# EAGLE design 311_lora_es920 (EAGLE 9.6.2)
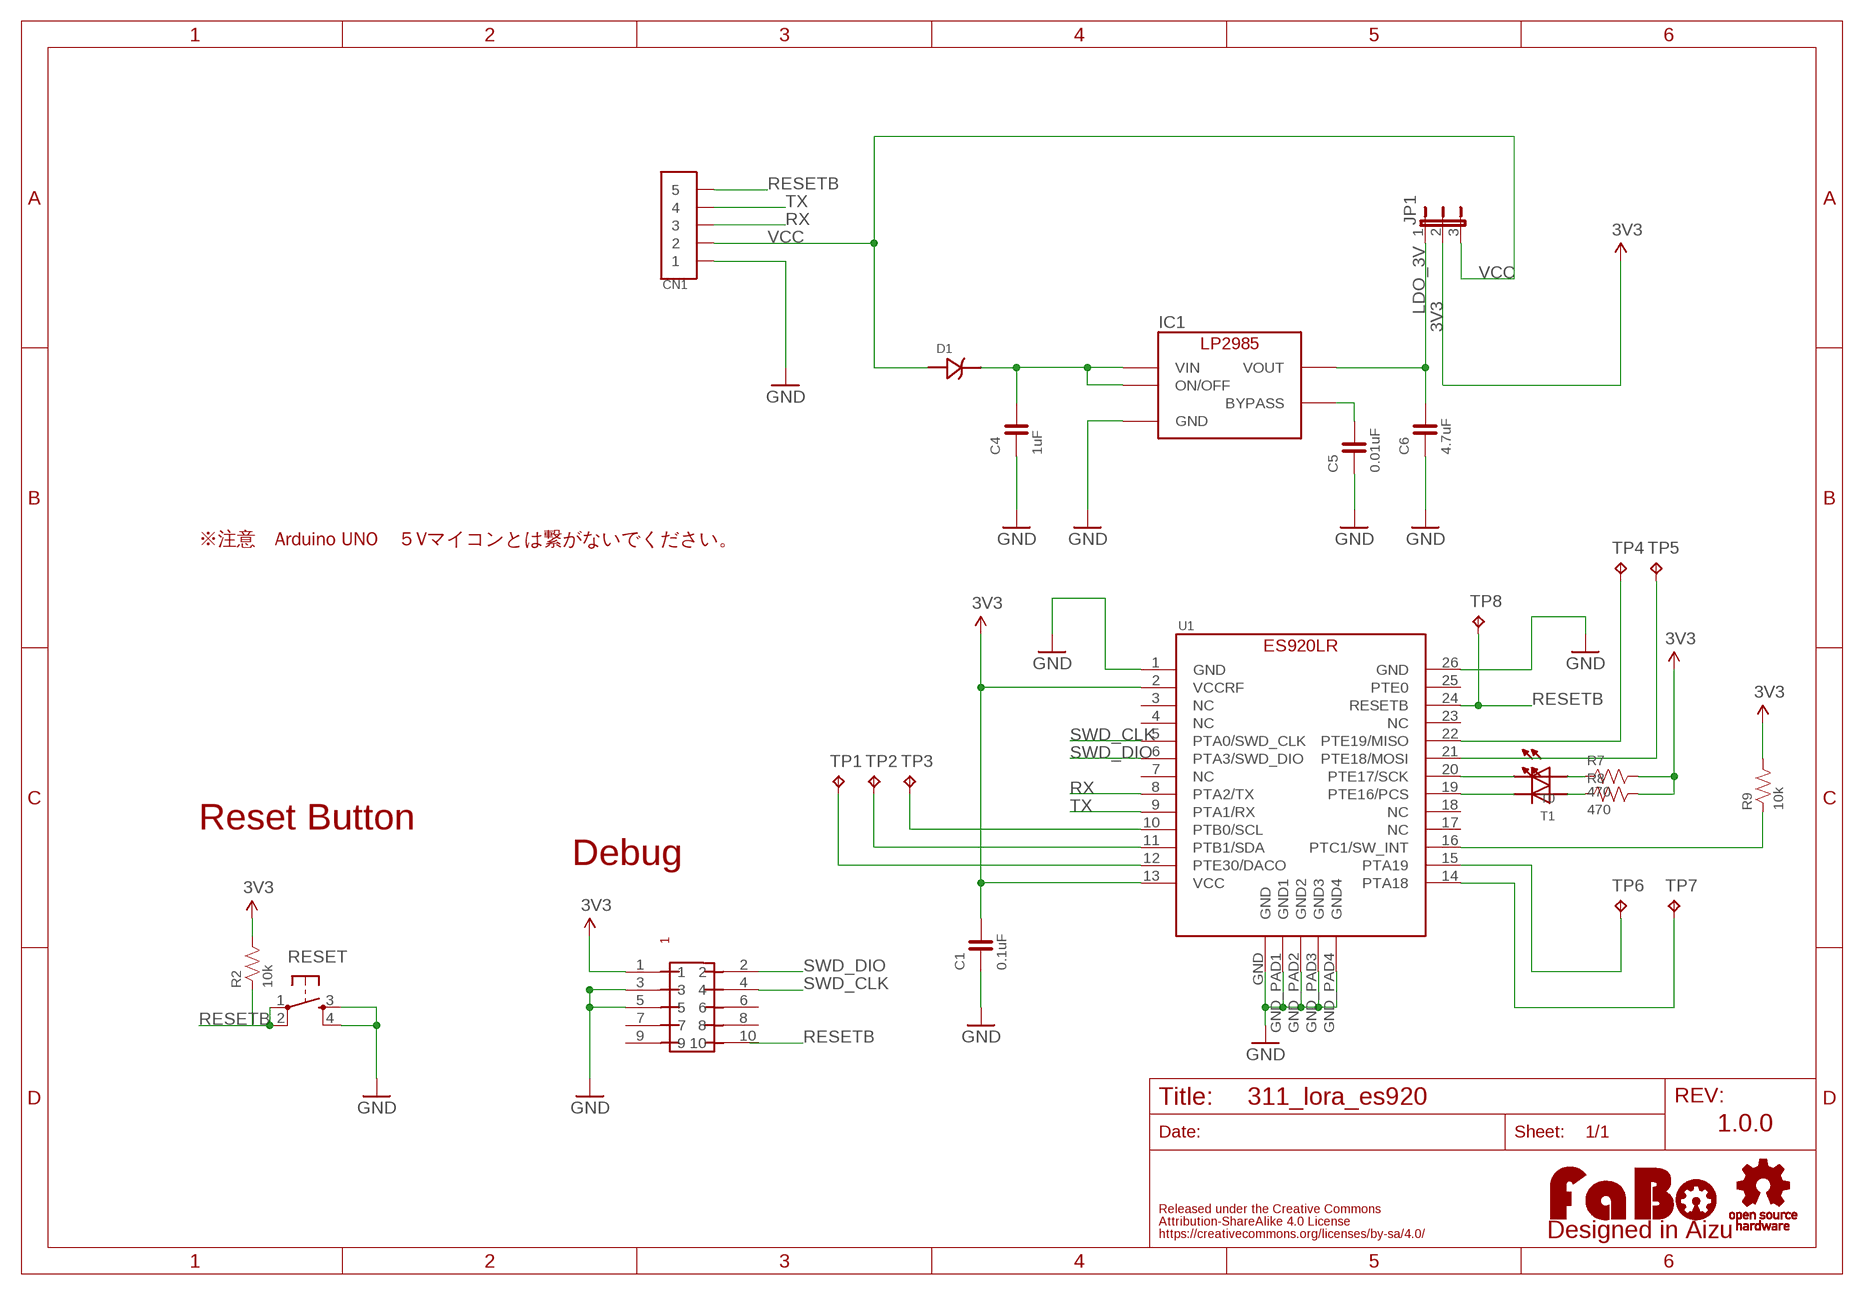
[diagram p0: schematic, sheet 1]

## Parts
C1  0.1uF  CAPACITOR-0603_NARROW  [0603-NARROW]
C4  1uF  CAPACITOR-0603_NARROW  [0603-NARROW]
C5  0.01uF  CAPACITOR-0603_NARROW  [0603-NARROW]
C6  4.7uF  CAPACITOR-0603_NARROW  [0603-NARROW]
CN1  SMD-CONN-5PIN-SM05B-PASS-1  [SM05B-PASS-1]
D1  CUS05F40  [CUS05F40]
IC1  LP2985-33DBV  [SOT-23-5]
JP1  JP2E  [JP2]
LOGO1  LOGO_FABO-M_BOTTOM  [LOGO_FABO_M_BOTTOM]
R2  10k  RESISTOR-0603-NARROW  [0603-NARROW]
R7  470  RESISTOR-0603-NARROW  [0603-NARROW]
R8  470  RESISTOR-0603-NARROW  [0603-NARROW]
R9  10k  RESISTOR-0603-NARROW  [0603-NARROW]
RESET  TACT-SWITCH-SMD_KMR2  [KMR2]
T0  LED-0603  [0603]
T1  LED-0603  [0603]
TP1  TPTP20R  [TP20R]
TP2  TPTP20R  [TP20R]
TP3  TPTP20R  [TP20R]
TP4  TPTP20R  [TP20R]
TP5  TPTP20R  [TP20R]
TP6  TPTP20R  [TP20R]
TP7  TPTP20R  [TP20R]
TP8  TPTP20R  [TP20R]
U1  ES920LR  [ES920LR]
U$3  LOGO_OSHW-M_BOTTOM  [LOGO_OSHW_M_BOTTOM]
U$8  PIN-HEADER-SMT(1.27MM)2X5  [PIN-HEADER-SMT(1.27MM)2X5]

## Nets
3V3: C1.2 JP1.2 R2.2 R7.2 R8.2 R9.2 U1.2(VCCRF) U1.13(VCC) U$8.1
GND: C1.1 C4.1 C5.1 C6.1 CN1.1 IC1.2(GND) RESET.3 RESET.4 U1.1(GND) U1.26(GND) U1.GND U1.GND_PAD1(GND1) U1.GND_PAD2(GND2) U1.GND_PAD3(GND3) U1.GND_PAD4(GND4) U$8.3 U$8.5
LDO_3V: C6.2 IC1.5(VOUT) JP1.1
N$3: T1.CATHODE U1.19(PTE16/PCS)
N$4: T0.CATHODE U1.20(PTE17/SCK)
N$5: R7.1 T0.ANODE
N$6: R8.1 T1.ANODE
N$7: R9.1 U1.16(PTC1/SW_INT)
N$9: C5.2 IC1.4(BYPASS)
N$10: TP6.TP U1.15(PTA19)
N$11: TP3.TP U1.10(PTB0/SCL)
N$12: TP2.TP U1.11(PTB1/SDA)
N$13: TP1.TP U1.12(PTE30/DACO)
N$14: TP4.TP U1.22(PTE19/MISO)
N$15: TP5.TP U1.21(PTE18/MOSI)
N$16: TP7.TP U1.14(PTA18)
N$17: C4.2 D1.C(CATHODE) IC1.1(VIN) IC1.3(ON/OFF)
RESETB: CN1.5 R2.1 RESET.1 RESET.2 TP8.TP U1.24(RESETB) U$8.10
RX: CN1.3 U1.8(PTA2/TX)
SWD_CLK: U1.5(PTA0/SWD_CLK) U$8.4
SWD_DIO: U1.6(PTA3/SWD_DIO) U$8.2
TX: CN1.4 U1.9(PTA1/RX)
VCC: CN1.2 D1.A(ANODE) JP1.3
Unconnected: U1.3(NC) U1.4(NC) U1.7(NC) U1.17(NC) U1.18(NC) U1.23(NC) U1.25(PTE0) U$8.6 U$8.7 U$8.8 U$8.9

## Notes on the sheet
- ※注意　Arduino UNO　５Vマイコンとは繋がないでください。
- Reset Button
- Debug
- 1.0.0

## Library data of the parts
C1 C4-C6 = FaBo-Capacitor:CAPACITOR: CAPACITOR
CN1 = FaBo-Connetor:SMD-CONN-5PIN
D1 = FaBo-Diode:CUS05F40
IC1 = FaBo-Supply:LP2985: LP2985
JP1 = jumper:JP2E: JUMPER
LOGO1 = component:LOGO_FABO
R2 R7-R9 = FaBo-Resistors:RESISTOR: RESISTOR
RESET = FaBo-Switch:TACT-SWITCH
T0 T1 = FaBo-LED:LED
TP1-TP8 = testpad:TP: Test pad
U1 = FaBo-LoRa:ES920LR
U$3 = component:LOGO_OSHW
U$8 = GClue:PIN-HEADER-SMT(1.27MM)2X5: PIN-HEADER-SMT (1.27MM) 2x5

## Board
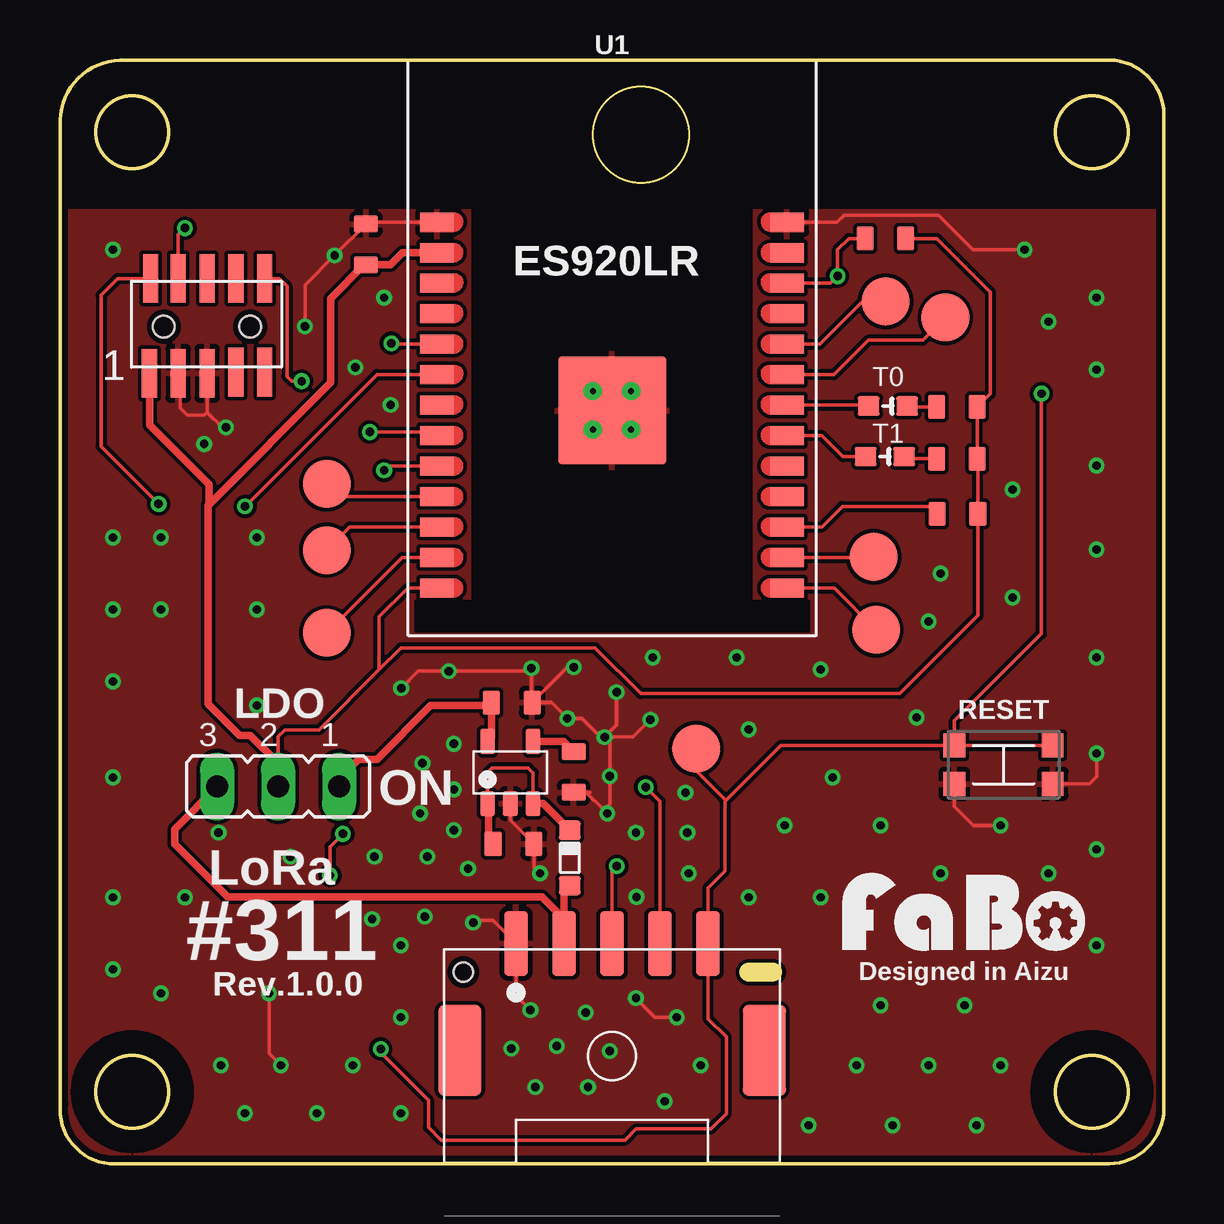
[diagram p1: board, top side]
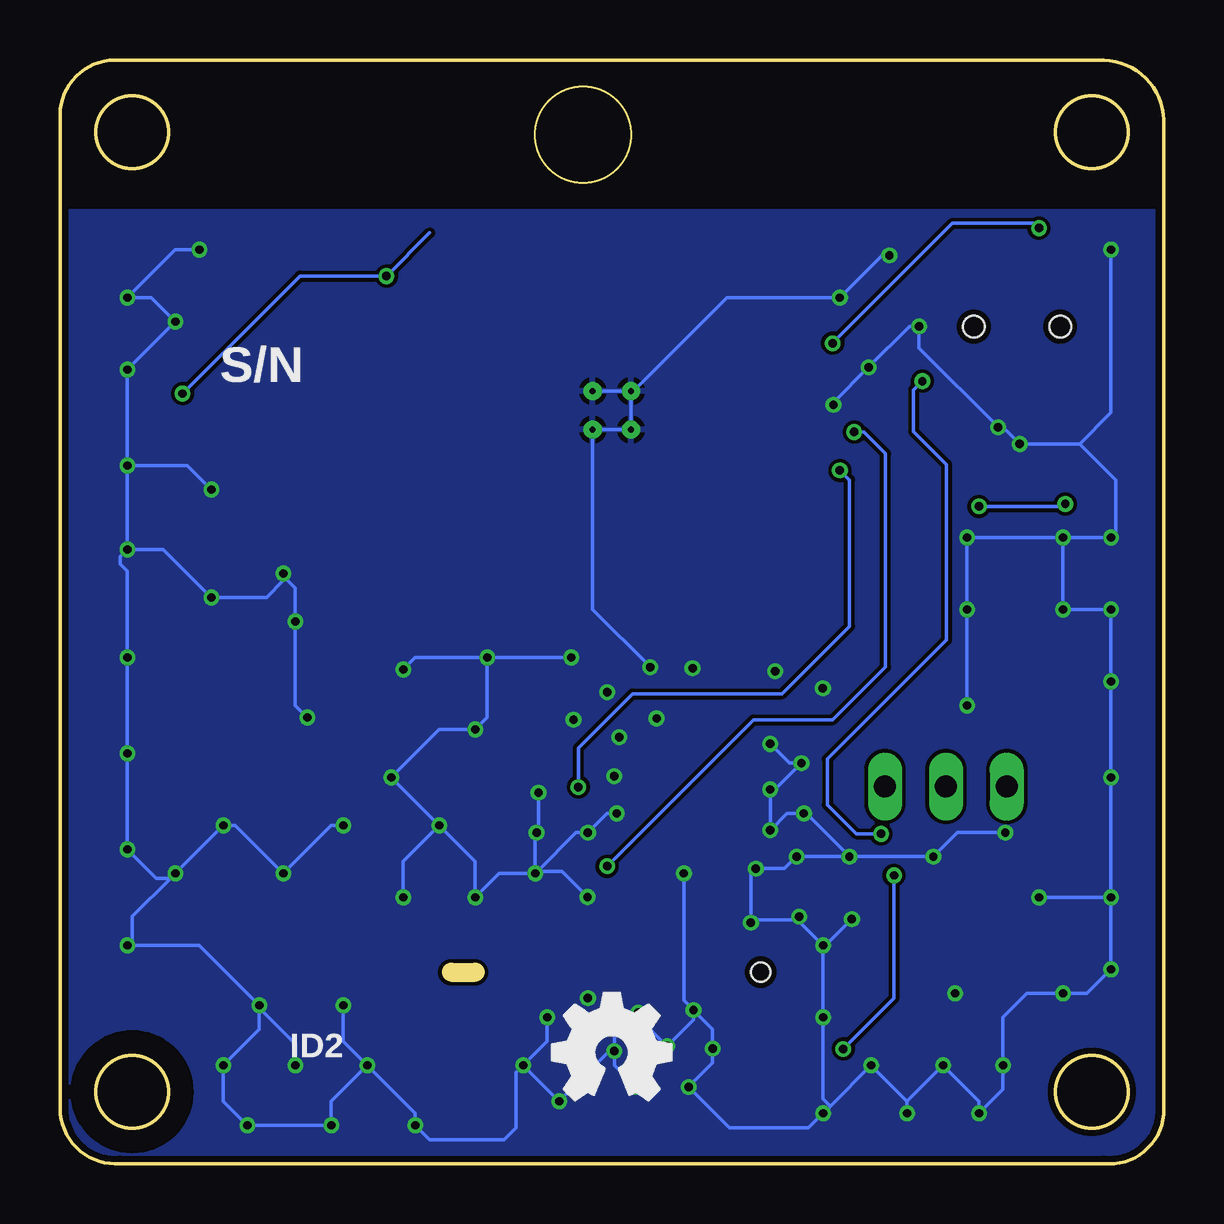
[diagram p2: board, bottom side, seen from below]

Size 46.02 x 46.02 mm. Coordinates in mm from the lower left corner, seen from the top.
Outline: 0.01,2.51 0.01,43.51 arc-87 2.51,46.01 43.51,46.01 arc-100 46.01,43.51 46.01,2.51 arc-99 43.51,0.01 2.51,0.01 arc-102 0.01,2.51
Outline: circle at 3.01,3.01 radius 1.5
Outline: circle at 43.01,3.01 radius 1.5
Outline: circle at 43.01,43.01 radius 1.5
Outline: circle at 3.01,43.01 radius 1.5
Copper layers (1*16): Top 0.035mm / dielectric 1.6mm / Bottom 0.035mm
Design rules "PCBway": minimum track width 6mil, minimum drill 12mil, track to track 6mil, track to pad 6mil, pad to pad 6mil, via to via 6mil, smd to smd 6mil, copper to edge 10mil, drill to drill 10mil, minimum pad ring 10mil, minimum via ring 6mil, stop-mask expansion 2mil, vias tented up to drill 100mil, thermal gap 8mil
tRestrict: area -2.6,39.8 to 50.4,50.8; area 0.5,0.5 to 5.5,5.5; area 40.5,0.5 to 45.5,5.5
bRestrict: area -2.6,39.8 to 50.4,50.8; area 40.5,0.5 to 45.5,5.5

### Footprints (pad centres in the part's own frame; a part is rotated, then mirrored left to right if it is on the bottom)
0603-NARROW = smd 0.71 x 1: 1 -0.85,0; 2 0.85,0
SM05B-PASS-1 = smd 1 x 2.7: 1 4,-11.85; 2 2,-11.85; 3 0,-11.85; 4 -2,-11.85; 5 -4,-11.85 | smd 1.8 x 3.8: P$1 6.35,-7.4; P$2 -6.35,-7.4 | hole 0.8: 6.2,-10.65
CUS05F40 = smd 0.8 x 0.9: A -1.15,0; C 1.15,0
SOT-23-5 = smd 0.6 x 1.05: 1 -0.95,-1.3; 2 0,-1.3; 3 0.95,-1.3; 4 0.95,1.3; 5 -0.95,1.3
JP2 = drill 0.914 long: 1 -2.54,0; 2 0,0; 3 2.54,0
KMR2 = smd 0.9 x 1: 1 -2.05,0.8; 2 2.05,0.8; 3 2.05,-0.8; 4 -2.05,-0.8
0603 = smd 0.9 x 0.8: ANODE -0.8,0; CATHODE 0.8,0
TP20R = smd 2 x 2: TP 0,0
ES920LR = smd 1.4 x 0.8: 1 -7.3,5.24; 2 -7.3,3.97; 3 -7.3,2.7; 4 -7.3,1.43; 5 -7.3,0.16; 6 -7.3,-1.11; 7 -7.3,-2.38; 8 -7.3,-3.65; 9 -7.3,-4.92; 10 -7.3,-6.19; 11 -7.3,-7.46; 12 -7.3,-8.73; 13 -7.3,-10; 14 7.3,-10; 15 7.3,-8.73; 16 7.3,-7.46; 17 7.3,-6.19; 18 7.3,-4.92; 19 7.3,-3.65; 20 7.3,-2.38; 21 7.3,0.16; 22 7.3,-1.11; 23 7.3,1.43; 24 7.3,2.7; 25 7.3,3.97; 26 7.3,5.24 | smd 4.5 x 4.5: GND 0,-2.6 | drill 0.25: GND_PAD1 -0.8,-1.8; GND_PAD2 0.8,-1.8; GND_PAD3 -0.8,-3.4; GND_PAD4 0.8,-3.4
PIN-HEADER-SMT(1.27MM)2X5 = smd 0.635 x 2.032: 1 -2.4,-1.95; 2 -2.35,2; 3 -1.2,-1.95; 4 -1.2,2; 5 0,-1.95; 6 0,2; 7 1.2,-1.9; 8 1.2,2; 9 2.4,-1.9; 10 2.4,2 | hole 0.9: 1.8,0; -1.8,0

### Placement (x,y rotation side)
C1  12.75,38.33 270 top
C4  18.9,13.34 180 top
C5  21.41,16.34 90 top
C6  18.83,19.23 180 top
CN1  23.01,-2.66 180 top
D1  21.25,12.76 90 top
IC1  18.77,16.32 0 top
JP1  9.09,15.73 180 top
LOGO1  37.68,8.52 0 bottom
R2  34.41,38.58 0 top
R7  37.39,31.56 0 top
R8  37.39,29.4 0 top
R9  37.41,27.11 0 top
RESET  39.33,16.64 0 top
T0  34.51,31.6 180 top
T1  34.39,29.49 180 top
TP1  11.12,22.14 0 top
TP2  11.12,25.59 0 top
TP3  11.12,28.35 0 top
TP4  36.91,35.28 0 top
TP5  34.42,35.96 0 top
TP6  33.92,25.31 0 top
TP7  34.02,22.27 0 top
TP8  26.51,17.31 0 top
U1  23.01,34.01 0 top
U$3  23.01,4.66 0 top
U$8  6.13,34.91 0 top

### Tracks (layer width: path | path; a pad name or v marks a point on that pad's centre or on a via)
3V3
  Top 0.152: 12.75,37.41 C1.2 | U1.13 14.51,24.01 13.31,22.81 13.31,20.61 | R8.2 38.24,29.51 | 38.24,29.51 R7.2 38.79,32.11 38.79,36.34 36.55,38.58 R2.2 | 38.24,29.51 38.26,29.49 R9.2 38.26,22.86 35.01,19.61 24.21,19.61 22.31,21.51 14.21,21.51 13.31,20.61 | 13.31,20.61 10.8,18.1 9.38,18.1 9.09,17.81 9.09,16.71
  Top 0.305: 6.21,27.49 6.21,28.31 3.73,30.79 U$8.1 | 6.21,27.49 6.18,27.46 6.18,19.17 7.48,17.87 7.93,17.87 9.09,16.71 JP1.2 | 6.21,27.49 11.28,32.56 11.28,36.08 12.68,37.48 C1.2 13.78,37.48 14.28,37.98 U1.2
GND  (via drill 0.35)
  Top 0.152: IC1.2 18.77,14.32 C4.1 19.75,12.37 v20.01,12.11 | 22.09,15.49 21.93,15.49 | 19.75,19.3 C6.1 20.49,19.23 v21.15,18.57 21.75,18.57 22.53,17.79 v22.7,17.79 | 19.75,19.3 21.16,20.71 v21.41,20.71 | U1.1 12.82,39.25 C1.1 v11.45,37.88 10.21,36.64 v10.21,34.91 | U$8.3 5.01,32.88 5.01,31.51 5.31,31.21 6.01,31.21 6.13,31.33 | U$8.5 6.13,31.33 | v19.61,6.41 19.01,7.01 CN1.1 18.05,10.15 17.31,10.15 v17.22,10.06 | 6.13,31.33 6.75,30.71 v6.91,30.71 | v9.21,4.11 8.71,4.61 v8.71,7.11 | U1.GND U1.GND_PAD2 | v22.81,14.61 22.67,14.75 | 22.67,14.75 21.93,15.49 | 21.93,15.49 C5.1 | v22.7,17.79 22.92,17.57 v22.92,16.17 22.92,15 22.67,14.75 | v25.71,6.11 24.81,6.11 v24.01,6.91 | v24.61,18.52 23.88,17.79 v22.7,17.79 | v22.7,17.79 23.2,18.29 v23.2,19.67 | v14.22,19.83 14.93,20.54 v16.21,20.54 19.52,20.54 v19.65,20.67 19.65,19.39 19.75,19.3 | U1.26 32.39,39.25 32.69,39.55 36.62,39.55 38.06,38.11 v40.21,38.11 | RESET.3 42.9,15.84 43.21,16.15 v43.21,17.11 | RESET.4 37.28,14.91 38.08,14.11 v39.21,14.11
  Bottom 0.152: v21.41,20.71 23.81,23.11 U1.GND_PAD4 U1.GND_PAD3 22.21,32.11 | 22.21,32.11 U1.GND_PAD1 U1.GND_PAD2 | v20.01,12.11 20.01,6.81 v19.61,6.41 | v11.45,37.88 11.75,37.88 v13.51,36.11 18.21,36.11 22.21,32.11 | 10.71,2.61 v9.21,4.11 7.71,2.61 v7.71,2.11 6.71,3.11 v6.71,4.11 6.71,6.11 5.71,7.11 v4.21,7.11 3.21,7.11 v2.21,8.11 v2.21,11.11 | v10.71,2.11 10.71,2.61 | 10.71,2.61 v12.21,4.11 13.91,2.41 | 13.91,2.41 v14.21,2.11 14.81,1.51 18.11,1.51 v19.81,3.21 18.81,4.21 v18.81,4.81 18.81,5.61 v19.61,6.41 | v5.21,11.11 v2.21,11.11 | v2.21,11.11 v2.21,16.11 v2.21,20.11 v2.21,23.11 v4.21,23.11 4.21,26.01 | 4.21,26.01 v4.21,26.11 v8.21,26.11 v8.21,23.11 v8.21,19.11 | 4.21,26.01 4.11,26.11 v2.21,26.11 2.01,26.31 2.01,28.51 3.51,30.01 | 3.51,30.01 v6.01,30.01 6.71,30.71 v6.91,30.71 10.21,34.01 v10.21,34.91 10.61,34.91 v12.31,33.21 13.78,31.74 v13.78,31.64 | v2.21,38.11 2.21,31.31 3.51,30.01 | v40.21,38.11 41.21,38.11 v43.21,36.11 42.21,36.11 v41.21,35.11 v43.21,33.11 v43.21,29.11 | v24.71,21.11 v28.21,21.11 | v28.21,21.11 31.21,21.11 v31.71,20.61 | v28.21,21.11 28.21,18.61 v28.71,18.11 30.21,18.11 v32.21,16.11 v30.21,14.11 | v30.21,14.11 28.71,12.61 v28.71,11.11 27.71,12.11 v26.21,12.11 | v30.21,14.11 31.71,12.61 v31.71,11.11 | v26.21,12.11 26.12,12.2 | 26.12,12.2 24.51,13.81 v24.01,13.81 23.21,14.61 v22.81,14.61 | v13.01,10.21 14.11,9.11 v14.21,9.11 | v14.21,9.11 15.21,10.11 v15.21,10.31 15.35,10.17 17.11,10.17 v17.22,10.06 17.22,12.1 v17.01,12.31 15.81,12.31 v15.31,12.81 v13.11,12.81 | v13.11,12.81 14.91,14.61 v15.01,14.61 15.71,14.61 v16.41,13.91 v16.41,15.61 16.21,15.61 v15.11,16.71 15.61,16.71 v16.41,17.51
  Bottom 0.152: v6.61,13.81 8.61,13.81 v9.61,12.81 v13.11,12.81 | 13.91,2.41 14.21,2.71 v14.21,6.11 v14.21,9.11 | v19.61,6.41 19.61,6.01 v20.71,4.91 21.91,6.11 v21.91,6.31 22.91,5.31 v22.91,4.71 | v22.91,4.71 22.91,4.11 v22.01,3.21 | v22.91,4.71 23.11,4.71 v25.21,2.61 v26.71,4.11 | v26.71,4.11 25.71,5.11 v25.71,6.11 | v26.71,4.11 27.01,3.81 27.01,1.51 27.51,1.01 30.61,1.01 v31.21,1.61 31.21,2.11 v33.21,4.11 | v33.21,4.11 34.71,2.61 v34.71,1.61 v38.21,1.61 39.21,2.61 v39.21,4.11 37.71,5.61 37.71,6.51 | 37.71,6.51 v37.71,6.61 40.21,9.11 43.01,9.11 | v36.21,4.11 36.21,5.01 37.71,6.51 | v34.21,6.61 34.21,5.11 v33.21,4.11 | 43.01,9.11 v43.21,9.11 | 41.41,11.91 v41.21,12.11 v39.21,14.11 38.71,14.11 v36.71,12.11 34.71,14.11 v34.21,14.11 | 41.41,11.91 43.01,10.31 43.01,9.11 | 41.41,11.91 42.01,11.91 v43.21,13.11 v43.21,17.11 v43.21,21.11 43.21,24.71 43.51,25.01 43.51,25.31 v43.21,25.61 | 36.71,24.51 36.71,24.31 37.41,23.61 v39.71,23.61 41.71,25.61 v43.21,25.61 | 36.71,24.51 v36.71,24.61 | 36.71,24.51 36.21,24.01 v36.21,22.61 36.21,19.11 v35.71,18.61 | v39.71,28.11 40.71,29.11 v43.21,29.11 | v43.21,25.61 v43.21,29.11 | v24.03,11.13 25.1,12.2 26.12,12.2 | v26.21,12.11 26.21,13.75 v26.15,13.81 26.07,13.89 v26.07,15.48
  pour Bottom: -11.79,-5.09 56.31,-5.09 56.31,55.01 -11.79,55.01
  pour Top: -8.89,-2.69 52.91,-2.69 52.91,52.31 -8.89,52.31
LDO_3V
  Top 0.152: 17.82,19.07 C6.2
  Top 0.305: 17.82,19.07 17.78,19.11 15.45,19.11 13.21,16.87 12.45,16.87 11.63,16.05 JP1.1 | C6.2 17.98,17.78 IC1.5
N$3
  Top 0.152: T1.CATHODE 32.64,29.49 31.76,30.36 U1.19
N$4
  Top 0.152: U1.20 33.67,31.63 T0.CATHODE
N$5
  Top 0.152: R7.1 35.34,31.56 T0.ANODE
N$6
  Top 0.152: R8.1 35.28,29.4 T1.ANODE
N$7
  Top 0.152: U1.16 31.75,26.55 32.61,27.41 36.26,27.41 R9.1
N$9
  Top 0.305: IC1.4 20.98,17.62 C5.2
N$10
  Top 0.152: U1.15 33.89,25.28 TP6.TP
N$11
  Top 0.152: U1.10 11.64,27.82 TP3.TP
N$12
  Top 0.152: TP2.TP 12.08,26.55 U1.11
N$13
  Top 0.152: TP1.TP 14.26,25.28 U1.12
N$14
  Top 0.152: TP4.TP 35.97,34.34 33.69,34.34 32.25,32.9 U1.22
N$15
  Top 0.152: U1.21 31.67,34.17 33.46,35.96 TP5.TP
N$16
  Top 0.152: U1.14 32.27,24.01 TP7.TP
N$17
  Top 0.152: 18.05,14.79 17.87,14.97 IC1.1 17.82,16.32 18.01,16.51 19.51,16.51 19.72,16.3 IC1.3
  Top 0.305: C4.2 17.87,13.52 17.87,14.97 | IC1.3 20.14,15.02 D1.C
RESETB  (via drill 0.35)
  Top 0.152: 8.53,37.43 U$8.10 9.14,36.91 9.46,36.59 9.46,32.83 9.66,32.63 v10.07,32.63 | U1.24 32.11,36.71 v32.41,37.01 32.41,38.11 32.88,38.58 R2.1 | RESET.1 RESET.2 | RESET.1 30.04,17.44 27.76,15.16 | 27.76,15.16 27.71,15.11 27.71,12.21 27.01,11.51 CN1.5 27.01,6.05 27.77,5.29 27.77,2.1 27.13,1.46 24.01,1.46 23.54,0.99 15.89,0.99 15.36,1.52 15.36,2.66 13.37,4.65 v13.37,4.79 | RESET.1 37.28,18.48 40.91,22.11 v40.91,32.11 | TP8.TP 26.51,16.41 27.76,15.16 | v11.79,13.76 11.25,13.22 v11.25,12.03
  Bottom 0.152: 30.61,38.81 v32.41,37.01 36.01,37.01 v40.91,32.11 | v10.07,32.63 10.44,32.26 10.44,30.53 9.07,29.16 9.07,21.84 14.03,16.88 14.03,14.97 12.82,13.76 v11.79,13.76 | v11.25,12.03 11.25,6.91 v13.37,4.79
RX  (via drill 0.35)
  Top 0.152: CN1.3 23.01,12.21 v23.21,12.41 | v12.91,30.51 15.56,30.51 U1.8
  Bottom 0.152: v23.21,12.41 17.11,18.51 13.81,18.51 11.61,20.71 11.61,29.61 12.51,30.51 v12.91,30.51
SWD_CLK  (via drill 0.35)
  Top 0.152: U1.5 13.85,34.17 v13.81,34.21 | v5.21,39.01 4.93,38.73 U$8.4
  Bottom 0.152: v13.81,34.21 8.81,39.21 5.41,39.21 v5.21,39.01
SWD_DIO  (via drill 0.35)
  Top 0.152: U$8.2 2.41,36.91 1.71,36.21 1.71,29.91 v4.11,27.51 | v7.71,27.41 13.21,32.91 U1.6
  Bottom 0.152: v7.71,27.41 4.21,27.41 v4.11,27.51
TX  (via drill 0.35)
  Top 0.152: CN1.4 25.01,15.11 v24.41,15.71 | v13.51,28.91 13.69,29.09 U1.9
  Bottom 0.152: v24.41,15.71 24.41,17.34 22.15,19.6 15.92,19.6 13.11,22.41 13.11,28.51 v13.51,28.91
VCC
  Top 0.152: 21.23,11.59 D1.A
  Top 0.305: 21.23,11.59 21.01,11.37 CN1.2 21.01,10.21 20.09,11.13 6.99,11.13 4.77,13.35 4.77,13.95 JP1.3

### Text on the board
tPlace: ES920LR | LDO | ON | LoRa | #311 | Rev.1.0.0 | Designed in Aizu
bPlace: S/N | ID2
Document: LoRa #311 ES920 / 2022/06/29 ALPHA